# Altium schematic sheet Port Expander Breakout.SchDoc
size A4; DrawnBy: Dylan Vogel; DocumentNumber: 5; Revision: v4.2; SheetNumber: 5; SheetTotal: 20
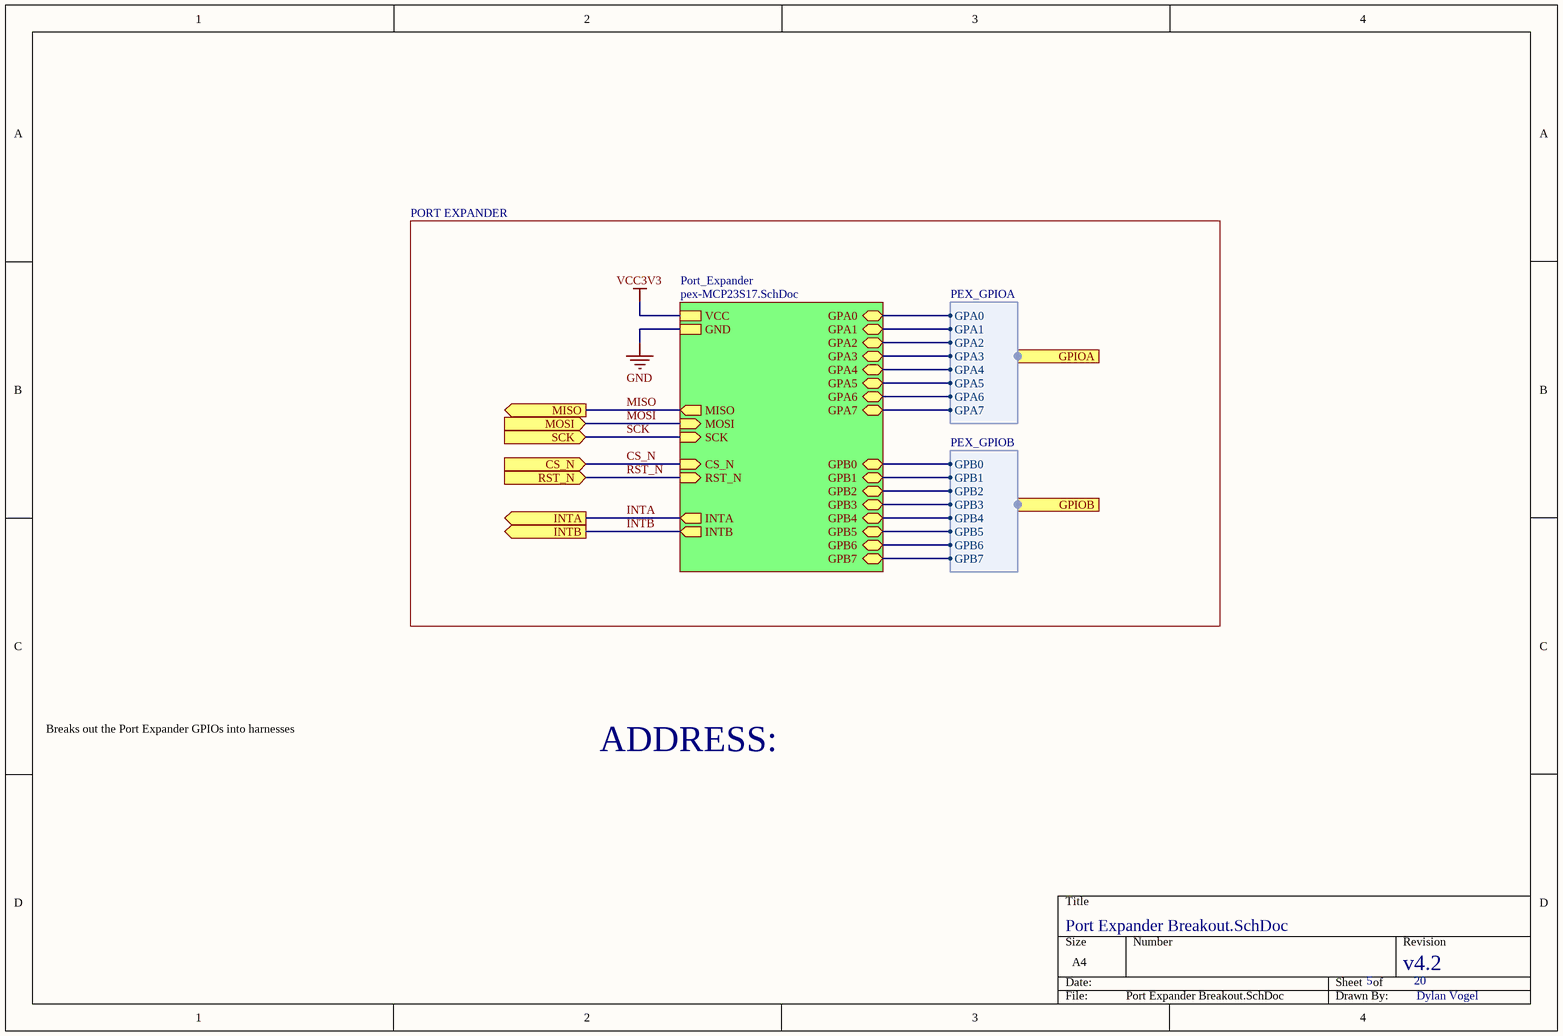
[diagram p0: Port Expander Breakout.SchDoc]

## Sub-sheets
Port_Expander = pex-MCP23S17.SchDoc: GPA0 (bidir), GPA6 (bidir), GPB1 (bidir), INTB (out), INTA (out), VCC, GND, MISO (out), MOSI (in), SCK (in), GPA4 (bidir), GPA2 (bidir), GPA7 (bidir), GPB6 (bidir), GPA5 (bidir), GPB7 (bidir), GPA3 (bidir), GPA1 (bidir), GPB4 (bidir), GPB2 (bidir), GPB3 (bidir), GPB5 (bidir), GPB0 (bidir), RST_N (in), CS_N (in)

## Ports
CS_N (in), GPIOA (harness PEX_GPIOA), GPIOB (harness PEX_GPIOB), INTA (out), INTB (out), MISO (out), MOSI (in), RST_N (in), SCK (in)

## Harnesses
PEX_GPIOA: GPA0, GPA1, GPA2, GPA3, GPA4, GPA5, GPA6, GPA7
PEX_GPIOB: GPB0, GPB1, GPB2, GPB3, GPB4, GPB5, GPB6, GPB7

## Nets
GND: sheet Port_Expander/GND
VCC3V3: sheet Port_Expander/VCC
CS_N: port CS_N, sheet Port_Expander/CS_N
INTA: port INTA, sheet Port_Expander/INTA
INTB: port INTB, sheet Port_Expander/INTB
MISO: port MISO, sheet Port_Expander/MISO
MOSI: port MOSI, sheet Port_Expander/MOSI
RST_N: port RST_N, sheet Port_Expander/RST_N
SCK: port SCK, sheet Port_Expander/SCK
(unnamed): sheet Port_Expander/GPA0, port GPIOA.GPA0
(unnamed): sheet Port_Expander/GPA6, port GPIOA.GPA6
(unnamed): sheet Port_Expander/GPB1, port GPIOB.GPB1
(unnamed): sheet Port_Expander/GPA4, port GPIOA.GPA4
(unnamed): sheet Port_Expander/GPA2, port GPIOA.GPA2
(unnamed): sheet Port_Expander/GPA7, port GPIOA.GPA7
(unnamed): sheet Port_Expander/GPB6, port GPIOB.GPB6
(unnamed): sheet Port_Expander/GPA5, port GPIOA.GPA5
(unnamed): sheet Port_Expander/GPB7, port GPIOB.GPB7
(unnamed): sheet Port_Expander/GPA3, port GPIOA.GPA3
(unnamed): sheet Port_Expander/GPA1, port GPIOA.GPA1
(unnamed): sheet Port_Expander/GPB4, port GPIOB.GPB4
(unnamed): sheet Port_Expander/GPB2, port GPIOB.GPB2
(unnamed): sheet Port_Expander/GPB3, port GPIOB.GPB3
(unnamed): sheet Port_Expander/GPB5, port GPIOB.GPB5
(unnamed): sheet Port_Expander/GPB0, port GPIOB.GPB0

## Notes on the sheet
- PORT EXPANDER
- ADDRESS:
- Breaks out the Port Expander GPIOs into harnesses